# EAGLE design Tr Final (EAGLE 9.6.2)
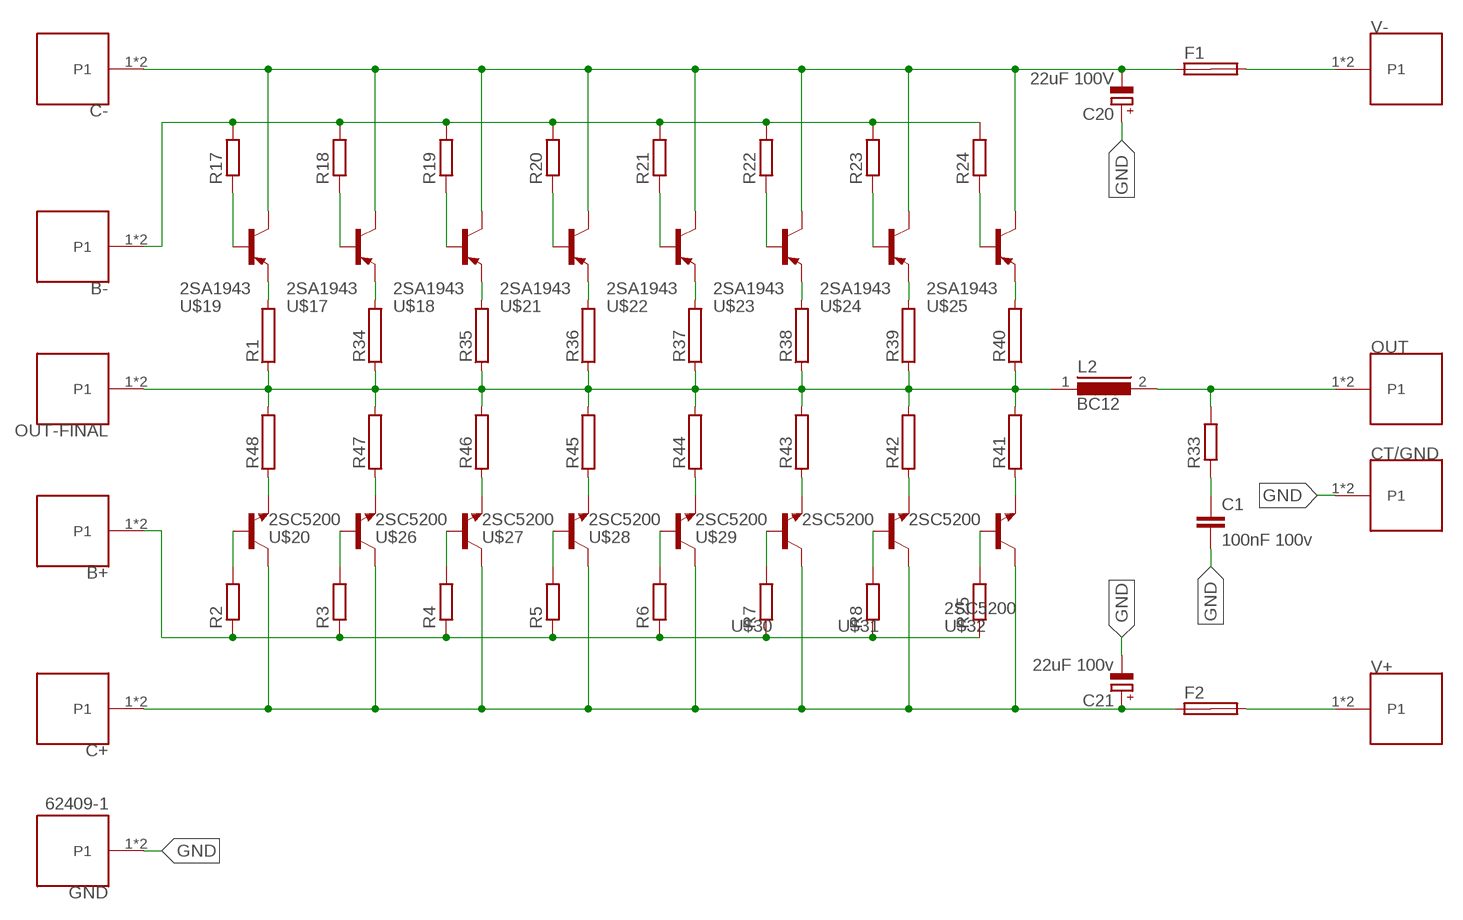
[diagram p0: schematic, sheet 1]

## Parts
B+  62409-1  [TE_62409-1]
B-  62409-1  [TE_62409-1]
C1  100nF 100v  C7.5/5  [C7.5B5]
C20  22uF 100V  CPOL-EUE3.5-8  [E3,5-8]
C21  22uF 100v  CPOL-EUE3.5-8  [E3,5-8]
C+  62409-1  [TE_62409-1]
C-  SKUN  62409-1  [TE_62409-1]
CT/GND  62409-1  [TE_62409-1]
F1  SHK20L  [SHK20L]
F2  SHK20L  [SHK20L]
GND  62409-1  [TE_62409-1]
L2  BC12  [BC12]
OUT  62409-1  [TE_62409-1]
OUT-FINAL  62409-1  [TE_62409-1]
R1  RMG100-V  [TO-247-2V]
R2  R-EU_0207/15  [0207/15]
R3  R-EU_0207/15  [0207/15]
R4  R-EU_0207/15  [0207/15]
R5  R-EU_0207/15  [0207/15]
R6  R-EU_0207/15  [0207/15]
R7  R-EU_0207/15  [0207/15]
R8  R-EU_0207/15  [0207/15]
R17  R-EU_0207/15  [0207/15]
R18  R-EU_0207/15  [0207/15]
R19  R-EU_0207/15  [0207/15]
R20  R-EU_0207/15  [0207/15]
R21  R-EU_0207/15  [0207/15]
R22  R-EU_0207/15  [0207/15]
R23  R-EU_0207/15  [0207/15]
R24  R-EU_0207/15  [0207/15]
R25  R-EU_0207/15  [0207/15]
R33  R-EU_0617/22  [0617/22]
R34  RMG100-V  [TO-247-2V]
R35  RMG100-V  [TO-247-2V]
R36  RMG100-V  [TO-247-2V]
R37  RMG100-V  [TO-247-2V]
R38  RMG100-V  [TO-247-2V]
R39  RMG100-V  [TO-247-2V]
R40  RMG100-V  [TO-247-2V]
R41  RMG100-V  [TO-247-2V]
R42  RMG100-V  [TO-247-2V]
R43  RMG100-V  [TO-247-2V]
R44  RMG100-V  [TO-247-2V]
R45  RMG100-V  [TO-247-2V]
R46  RMG100-V  [TO-247-2V]
R47  RMG100-V  [TO-247-2V]
R48  RMG100-V  [TO-247-2V]
U$17  2SA1943  [TO-264]
U$18  2SA1943  [TO-264]
U$19  2SA1943  [TO-264]
U$20  2SC5200  [TO-264]
U$21  2SA1943  [TO-264]
U$22  2SA1943  [TO-264]
U$23  2SA1943  [TO-264]
U$24  2SA1943  [TO-264]
U$25  2SA1943  [TO-264]
U$26  2SC5200  [TO-264]
U$27  2SC5200  [TO-264]
U$28  2SC5200  [TO-264]
U$29  2SC5200  [TO-264]
U$30  2SC5200  [TO-264]
U$31  2SC5200  [TO-264]
U$32  2SC5200  [TO-264]
V+  62409-1  [TE_62409-1]
V-  62409-1  [TE_62409-1]

## Nets
GND: C1.2 C20.+ C21.- CT/GND.1 CT/GND.2(P1) GND.1 GND.2(P1)
N$1: R17.1 U$19.B
N$2: R18.1 U$17.B
N$3: R19.1 U$18.B
N$4: R20.1 U$21.B
N$5: R21.1 U$22.B
N$6: R22.1 U$23.B
N$7: R23.1 U$24.B
N$8: R24.1 U$25.B
N$9: R1.2 U$19.E
N$10: R34.2 U$17.E
N$11: R35.2 U$18.E
N$12: R36.2 U$21.E
N$13: R37.2 U$22.E
N$14: R38.2 U$23.E
N$15: R39.2 U$24.E
N$16: R40.2 U$25.E
N$17: L2.1 OUT-FINAL.1 OUT-FINAL.2(P1) R1.1 R34.1 R35.1 R36.1 R37.1 R38.1 R39.1 R40.1 R41.2 R42.2 R43.2 R44.2 R45.2 R46.2 R47.2 R48.2
N$18: L2.2 OUT.1 OUT.2(P1) R33.2
N$19: C20.- C-.1 C-.2(P1) F1.1A U$17.C U$18.C U$19.C U$21.C U$22.C U$23.C U$24.C U$25.C
N$20: F2.2A V+.1 V+.2(P1)
N$21: F1.2A V-.1 V-.2(P1)
N$23: C1.1 R33.1
N$25: R48.1 U$20.E
N$26: R47.1 U$26.E
N$27: R46.1 U$27.E
N$28: R45.1 U$28.E
N$29: R44.1 U$29.E
N$30: R43.1 U$30.E
N$31: R42.1 U$31.E
N$32: R41.1 U$32.E
N$33: R2.2 U$20.B
N$34: R3.2 U$26.B
N$35: R4.2 U$27.B
N$36: R5.2 U$28.B
N$37: R6.2 U$29.B
N$38: R7.2 U$30.B
N$39: R8.2 U$31.B
N$40: R25.2 U$32.B
N$42: C21.+ C+.1 C+.2(P1) F2.1A U$20.C U$26.C U$27.C U$28.C U$29.C U$30.C U$31.C U$32.C
N$50: B-.1 B-.2(P1) R17.2 R18.2 R19.2 R20.2 R21.2 R22.2 R23.2 R24.2
N$51: B+.1 B+.2(P1) R2.1 R3.1 R4.1 R5.1 R6.1 R7.1 R8.1 R25.1
Unconnected: F1.1B F1.2B F2.1B F2.2B

## Library data of the parts
B+ B- C+ C- CT/GND GND OUT OUT-FINAL V+ V- = 62409-1:62409-1: CONN QC TAB 0.250 SOLDER Check availability <https://pricing.snapeda.com/parts/62409-1/TE%20Connectivity/view-part?ref=eda>; AVAILABILITY: In Stock; COMMENT: 62409-1; DESCRIPTION: Faston 20-16 AWG Straight Non-Insulated Printed Circuit Board Tab Terminal; MF: TE Connectivity; MP: 62409-1; PACKAGE: None; PRICE: None; PURCHASE-URL: https://pricing.snapeda.com/search?q=62409-1&ref=eda
C1 = capacitor edit 8,1:C: CAPACITOR naming: grid - package width
C20 C21 = rcl:CPOL-EU: POLARIZED CAPACITOR, European symbol; SPICEPREFIX: C
F1 F2 = fuse:SHK20L: FUSE HOLDER 5 x 20 mm, SH contact, SHH1 Schukat, E1073 Buerklin; OC_FARNELL: unknown; OC_NEWARK: unknown
L2 = inductor gindring:BC12: INDUCTOR; SPICEPREFIX: L
R1 R34-R48 = resistor-power:RMG100: TO-247 Power Resistor - RMG 100 Series Source: www.token.com.tw .. power-resistor-rmg100pdf; OC_FARNELL: unknown; OC_NEWARK: unknown
R2-R8 R17-R25 = resistor coba:R-EU_: RESISTOR, European symbol; SPICEPREFIX: R
R33 = rcl:R-EU_: RESISTOR, European symbol; SPICEPREFIX: R
U$17-U$19 U$21-U$25 = GP-TR1943:2SA1943
U$20 U$26-U$32 = GP-TR1943:2SC5200

## Board
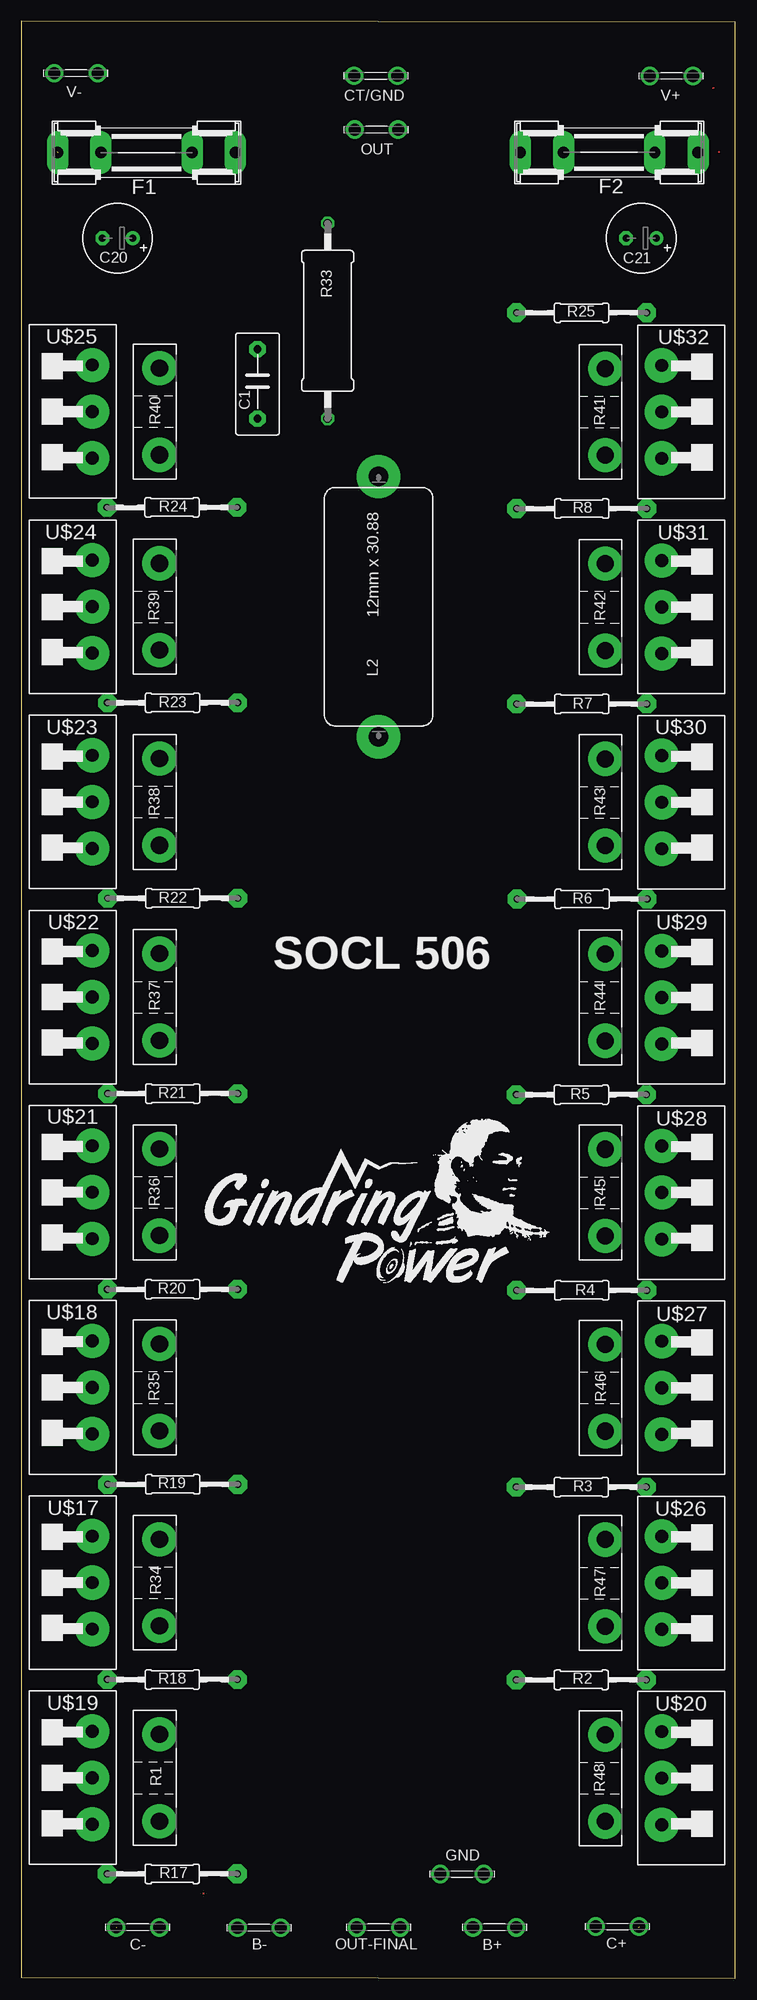
[diagram p1: board, top side]
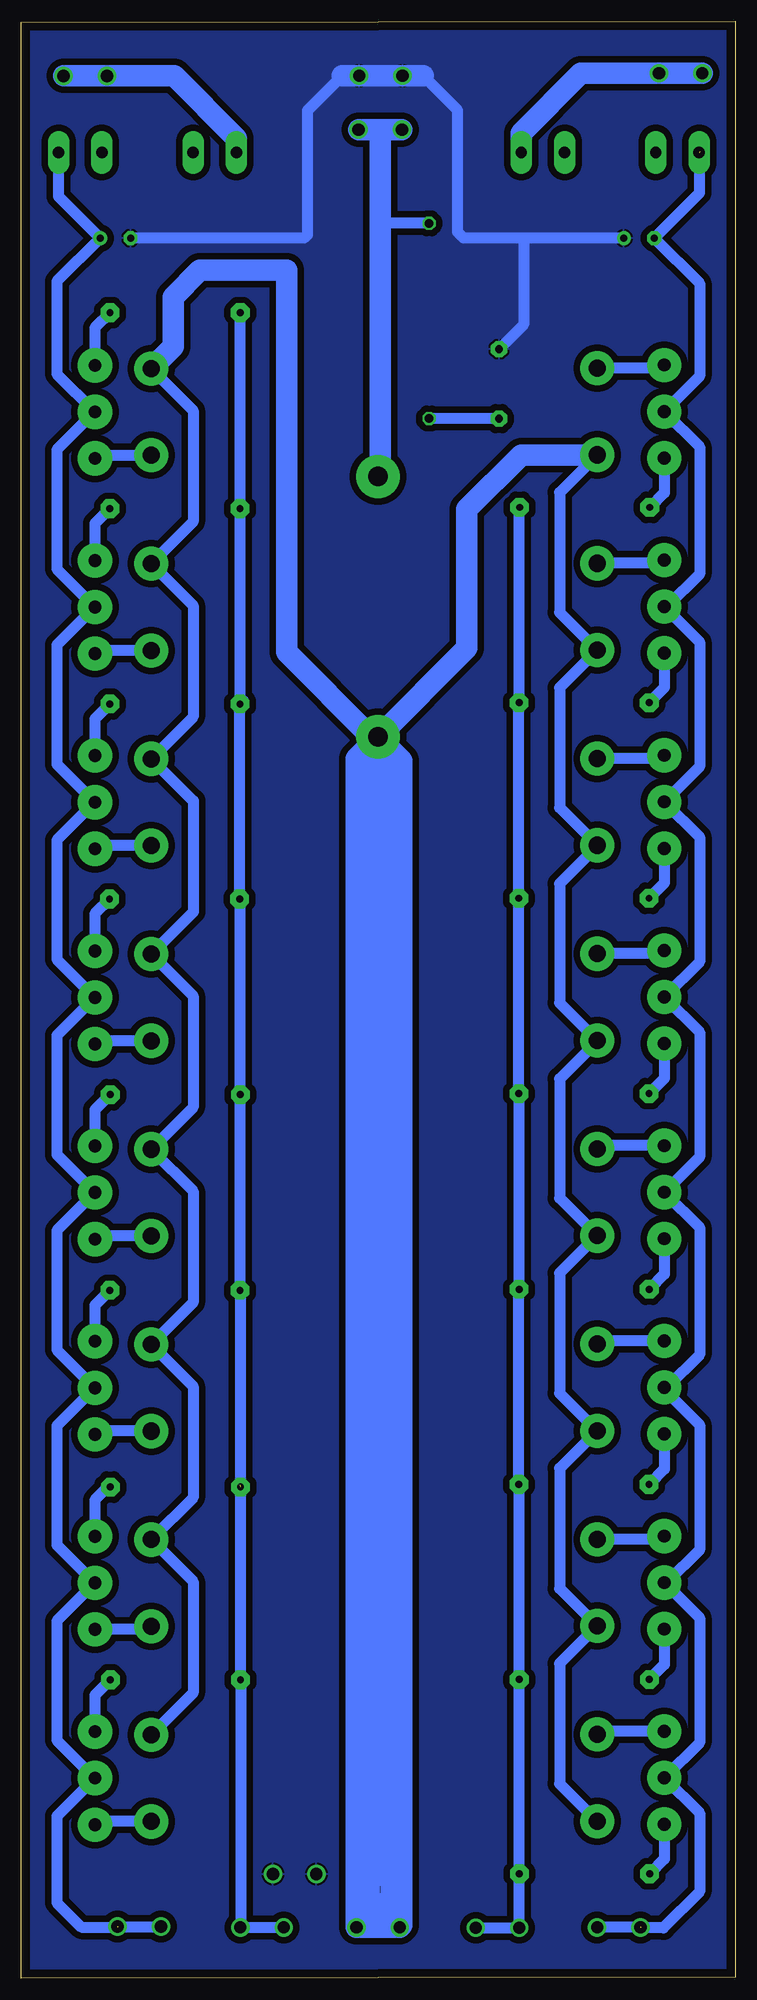
[diagram p2: board, bottom side, seen from below]

Size 83.6 x 229.19 mm. Coordinates in mm from the lower left corner, seen from the top.
Outline: 83.6,0 83.6,229.09 0,229.19 0,0.1 83.6,0
Copper layers (1*16): Top 0.035mm / dielectric 1.5mm / Bottom 0.035mm
Design rules "default *": minimum track width 6mil, minimum drill 0.35mm, track to track 30mil, track to pad 30mil, pad to pad 30mil, via to via 30mil, smd to smd 30mil, copper to edge 40mil, drill to drill 6mil, minimum pad ring 10mil, minimum via ring 8mil, stop-mask expansion 4mil, vias tented up to drill 0mil, thermal gap 10mil

### Footprints (pad centres in the part's own frame; a part is rotated, then mirrored left to right if it is on the bottom)
TE_62409-1 = drill 1.43: 1 -2.54,0; 2 2.54,0
C7.5B5 = drill 0.914 pad 1.905 octagon: 1 -3.81,0; 2 4.318,0
E3,5-8 = drill 0.813 pad 1.6: + -1.778,0 | drill 0.813 pad 1.6 octagon: - 1.778,0
SHK20L = drill 1.321 pad 2.54 long: 1A -10.414,0; 1B -5.334,0; 2A 10.414,0; 2B 5.334,0
BC12 = drill 2.286 pad 5.08: 1 -13.97,0; 2 16.51,0
TO-247-2V = drill 2 pad 4: 1 -5.08,0; 2 5.08,0
0207/15 = drill 0.813 pad 2.184 octagon: 1 -7.62,0; 2 7.62,0
0617/22 = drill 1.016 octagon: 1 -11.43,0; 2 11.43,0
TO-264 = drill 1.5 pad 4: B -5.45,-6.096; E 5.45,-6.096 | drill 1.499 pad 4: C 0,-6.096

### Placement (x,y rotation side)
B+  55.42,5.94 180 top
B-  27.84,5.9 180 top
C1  27.66,186.47 90 top
C20  11.27,203.8 180 top
C21  72.59,203.8 180 top
C+  69.79,6.05 0 top
C-  13.64,5.94 180 top
CT/GND  41.51,222.82 0 top
F1  14.66,213.82 0 top
F2  68.83,213.84 180 top
GND  51.6,12.19 0 top
L2  41.83,159.36 90 top
OUT  41.58,216.51 180 top
OUT-FINAL  41.82,5.94 180 top
R1  16.18,23.47 90 top
R2  65.56,34.94 0 top
R3  65.56,57.52 0 top
R4  65.62,80.56 0 top
R5  65.58,103.48 0 top
R6  65.66,126.4 0 top
R7  65.62,149.24 0 top
R8  65.62,172.12 0 top
R17  17.66,12.22 0 top
R18  17.68,34.98 0 top
R19  17.72,57.84 0 top
R20  17.7,80.68 0 top
R21  17.72,103.6 0 top
R22  17.72,126.48 0 top
R23  17.7,149.38 0 top
R24  17.64,172.26 0 top
R25  65.6,195.06 0 top
R33  35.86,194.11 90 top
R34  16.18,46.33 90 top
R35  16.18,69.19 90 top
R36  16.18,92.05 90 top
R37  16.18,114.91 90 top
R38  16.18,137.77 90 top
R39  16.18,160.63 90 top
R40  16.18,183.49 90 top
R41  68.38,183.45 90 top
R42  68.38,160.59 90 top
R43  68.38,137.73 90 top
R44  68.38,114.87 90 top
R45  68.38,92.01 90 top
R46  68.38,69.15 90 top
R47  68.38,46.29 90 top
R48  68.38,23.43 90 top
U$17  2.21,46.33 90 top
U$18  2.21,69.19 90 top
U$19  2.21,23.47 90 top
U$20  81.08,23.43 270 top
U$21  2.21,92.05 90 top
U$22  2.21,114.91 90 top
U$23  2.21,137.77 90 top
U$24  2.21,160.63 90 top
U$25  2.21,183.49 90 top
U$26  81.08,46.29 270 top
U$27  81.08,69.15 270 top
U$28  81.08,92.01 270 top
U$29  81.08,114.87 270 top
U$30  81.08,137.73 270 top
U$31  81.08,160.59 270 top
U$32  81.08,183.45 270 top
V+  76.11,222.8 180 top
V-  6.4,223.1 180 top

### Tracks (layer width: path | path; a pad name or v marks a point on that pad's centre or on a via)
GND
  Bottom 1.27: 36.55,222.82 32.51,218.78 32.51,204.5 31.81,203.8 24.77,203.8 | 46.02,222.82 50.1,218.74 50.1,204.18 50.48,203.8 C21.- | C20.+ 24.77,203.8 | 24.77,203.8 24.77,193.67 C1.2
  Bottom 2.54: 36.55,222.82 CT/GND.1 CT/GND.2 46.02,222.82
  pour Bottom (rank 6): 0,229.21 83.68,229.21 83.68,0.01 0,0.01
N$1
  Bottom 1.27: U$19.B 8.31,13.96 R17.1
N$2
  Bottom 1.27: U$17.B 8.31,36.74 R18.1
N$3
  Bottom 1.27: U$18.B 8.31,59.64 R19.1
N$4
  Bottom 1.27: U$21.B 8.31,82.46 R20.1
N$5
  Bottom 1.27: U$22.B 8.31,105.4 R21.1
N$6
  Bottom 1.27: U$23.B 8.31,128.28 R22.1
N$7
  Bottom 1.27: U$24.B 8.31,151.16 R23.1
N$8
  Bottom 1.27: U$25.B 8.31,173.98 R24.1
N$9
  Bottom 1.27: U$19.E 15.81,28.92 R1.2
N$10
  Bottom 1.27: U$17.E 8.68,51.41 R34.2
N$11
  Bottom 1.27: U$18.E 15.81,74.64 R35.2
N$12
  Bottom 1.27: U$21.E 15.81,97.5 R36.2
N$13
  Bottom 1.27: U$22.E 8.68,119.99 R37.2
N$14
  Bottom 1.27: U$23.E 8.68,142.85 R38.2
N$15
  Bottom 1.27: U$24.E 8.68,165.71 R39.2
N$16
  Bottom 1.27: U$25.E 8.68,188.57 R40.2
N$17
  Bottom 1.27: R41.2 63.47,183.62 63.47,170.58 R42.2 63.47,160.76 63.47,147.72 R43.2 63.45,137.88 63.45,124.88 R44.2 63.47,115.04 63.47,102 R45.2 63.47,92.18 63.47,79.14 R46.2 63.47,69.32 63.47,56.28 R47.2 63.47,46.46 63.47,33.42 R48.2 | R40.1 20.58,174.01 20.58,159.95 R39.1 20.58,151.15 20.58,137.09 R38.1 16.18,132.59 20.58,128.19 20.58,114.23 R37.1 16.18,109.73 20.58,105.33 20.58,91.37 R36.1 20.58,82.57 20.58,68.51 R35.1 20.56,59.73 20.56,45.63 R34.1 20.56,36.87 20.56,22.77 R1.1
  Bottom 2.54: R41.2 65.84,191.07 65.84,196.89 62.71,200.02 52.55,200.02 52.55,155.32 42.63,145.39 L2.1 | R40.1 25.07,178.41 31.42,172.06 31.42,155.8 L2.1 | 39.04,13.31 39.04,6.19 OUT-FINAL.2 OUT-FINAL.1 44.36,142.86 L2.1 | 39.04,13.31 42.85,13.31 | 42.85,13.31 42.85,8.23 40.31,8.23 40.31,9.5 | 40.31,9.5 40.31,12.04 | 39.04,13.31 39.04,142.6 L2.1 | L2.1 43.61,143.61 43.61,7.21 42.6,7.21 40.31,9.5 | 44.36,11.8 42.85,13.31 | L2.1 41.83,12.29 41.58,12.04 39.67,13.95 39.67,39.35 40.31,39.98 40.31,143.87 L2.1
N$18
  Bottom 1.27: R33.2 41.55,205.54 41.58,205.57
  Bottom 2.54: 41.58,216.51 41.58,205.57 41.58,176.12 L2.2 | OUT.2 41.58,216.51 | 41.58,216.51 OUT.1
N$19  (2 unrouted)
  Bottom 1.27: U$17.C 8,46.33 4.19,50.14 4.19,64.82 8.31,68.94 U$18.C 8,69.19 4.19,73 4.19,87.94 U$21.C 4.19,96.17 4.19,110.8 U$22.C 4.19,119.03 4.19,133.66 U$23.C 4.19,141.89 4.19,156.52 U$24.C 8,160.63 4.19,164.44 4.19,179.38 U$25.C 4.19,187.61 4.19,198.5 C20.- 4.19,209.1 4.19,213.92 | 8.56,46.33 U$17.C | U$17.C 4.19,42.22 4.19,27.59 U$19.C 4.19,19.36 4.19,10.12 8.42,5.89 11.14,5.89 | C-.2 C-.1
N$20
  Bottom 2.54: F2.2A 58.41,215.51 65.7,222.8 V+.2 V+.1
N$21
  Bottom 2.54: F1.2A 25.07,216.11 18.08,223.1 V-.1 V-.2
N$22
  Top 0.152: 80.98,221.34 81.06,221.42
N$23
  Bottom 1.27: C1.1 27.68,182.68 R33.1
N$24
  Top 0.152: 21.36,9.95 21.3,9.89
N$25
  Bottom 1.27: R48.1 74.62,18.35 U$20.E
N$26
  Bottom 1.27: R47.1 68.75,40.84 U$26.E
N$27
  Bottom 1.27: R46.1 74.62,64.07 U$27.E
N$28
  Bottom 1.27: R45.1 74.62,86.93 U$28.E
N$29
  Bottom 1.27: R44.1 74.62,109.79 U$29.E
N$30
  Bottom 1.27: R43.1 74.62,132.65 U$30.E
N$31
  Bottom 1.27: R42.1 74.62,155.51 U$31.E
N$32
  Bottom 1.27: U$32.E 74.62,178.37 R41.1
N$33
  Bottom 1.27: R2.2 74.99,33.13 U$20.B
N$34
  Bottom 1.27: U$26.B 74.99,56.01 73.48,57.52 R3.2
N$35
  Bottom 1.27: U$27.B 74.99,74.48 74.73,74.23 74.73,74.35 U$27.B | R4.2 74.99,78.81 U$27.B
N$36
  Bottom 1.27: U$28.B 74.99,97.34 74.73,97.09 74.73,97.21 U$28.B | R5.2 74.99,101.69 U$28.B
N$37
  Bottom 1.27: R6.2 74.99,124.69 U$29.B
N$38
  Bottom 1.27: U$30.B 74.99,143.06 74.73,142.81 74.73,142.93 U$30.B | R7.2 74.99,147.49 U$30.B
N$39
  Bottom 1.27: R8.2 74.99,170.37 U$31.B
N$40
  Bottom 1.27: U$32.B 74.99,188.78 74.73,188.53 74.73,188.65 U$32.B | R25.2 74.99,193.29 U$32.B
N$41
  Top 0.152: 81.67,213.86 81.73,213.92
N$42  (1 unrouted)
  Bottom 1.27: 72.25,5.99 76.57,5.99 79.43,8.85 79.43,18.98 U$20.C 79.43,27.87 79.43,41.84 U$26.C 79.43,50.73 79.43,64.7 U$27.C 79.43,73.59 79.43,87.56 U$28.C 79.43,96.45 79.43,110.42 U$29.C 79.43,119.31 79.43,133.28 U$30.C 79.43,142.17 79.43,156.14 U$31.C 79.43,165.03 79.43,179 U$32.C 79.43,187.89 79.43,198.74 C21.+ 79.24,208.68 F2.1A | C+.2 C+.1
N$50
  Bottom 1.27: B-.1 B-.2 25.3,12.2 R17.2 25.28,34.96 R18.2 25.3,57.8 R19.2 25.34,80.66 R20.2 25.32,103.58 R21.2 R22.2 25.34,149.36 R23.2 25.32,172.2 R24.2
N$51  (1 unrouted)
  Bottom 1.27: R4.1 | R4.1 58,103.44 R5.1 57.96,126.32 R6.1 58.04,149.16 57.57,149.63 57.61,149.63 R7.1 R8.1 58,195.04 R25.1 | 57.96,34.92 R2.1 | R2.1 57.94,5.96 B+.1 B+.2 | R2.1 57.94,57.7 58,57.76 | R3.1 57.94,80.5 R4.1

### Text on the board
tNames: SOCL 506